# Altium schematic sheet Power_Regulators_RF_4.SchDoc
size A4; DocumentNumber: 38; SheetNumber: 38; SheetTotal: 47
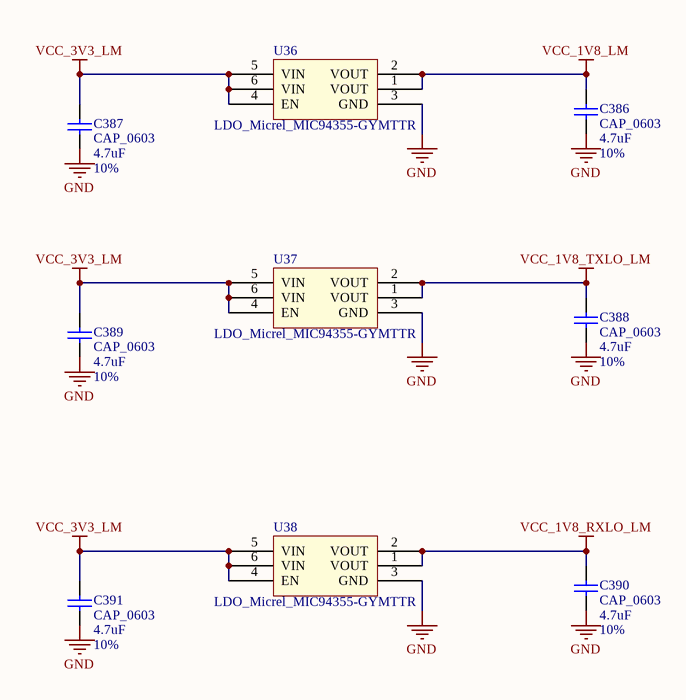
[diagram p0: Power_Regulators_RF_4.SchDoc]

## Parts
C386  CAP_0603  value 4.7uF  Tolerance: 10%  [CAPC0603(1608)100_N]
C387  CAP_0603  value 4.7uF  Tolerance: 10%  [CAPC0603(1608)100_N]
C388  CAP_0603  value 4.7uF  Tolerance: 10%  [CAPC0603(1608)100_N]
C389  CAP_0603  value 4.7uF  Tolerance: 10%  [CAPC0603(1608)100_N]
C390  CAP_0603  value 4.7uF  Tolerance: 10%  [CAPC0603(1608)100_N]
C391  CAP_0603  value 4.7uF  Tolerance: 10%  [CAPC0603(1608)100_N]
U36  LDO_Micrel_MIC94355-GYMTTR  [LDO_Micrel_MIC94325YMTTR_TDFN-6]
U37  LDO_Micrel_MIC94355-GYMTTR  [LDO_Micrel_MIC94325YMTTR_TDFN-6]
U38  LDO_Micrel_MIC94355-GYMTTR  [LDO_Micrel_MIC94325YMTTR_TDFN-6]

## Nets
GND: C386.1 C387.1 C388.1 C389.1 C390.1 C391.1 U36.3(GND) U37.3(GND) U38.3(GND)
VCC_1V8_LM: C386.2 U36.1(VOUT) U36.2(VOUT)
VCC_1V8_RXLO_LM: C390.2 U38.1(VOUT) U38.2(VOUT)
VCC_1V8_TXLO_LM: C388.2 U37.1(VOUT) U37.2(VOUT)
VCC_3V3_LM: C387.2 C389.2 C391.2 U36.4(EN) U36.5(VIN) U36.6(VIN) U37.4(EN) U37.5(VIN) U37.6(VIN) U38.4(EN) U38.5(VIN) U38.6(VIN)

## Library data of the parts
C386-C391 = LMK107BJ475KA-T: 4.7uF, ceramic, 10%, 10V X5R, 0603; Manufacturer: Taiyo Yuden; Part Number: LMK107BJ475KA-T; Footprint Ref: CAPC0603(1608)100_N; Library Ref: CAP_0603
U36-U38 = LDO_Micrel_MIC94355-GYMTTR: IC REG LDO 1.8V .5A 6TDFN; Manufacturer: Micrel Inc; Footprint Ref: LDO_Micrel_MIC94325YMTTR_TDFN-6; Library Ref: LDO_Micrel_MIC94355-GYMTTR; Part Number: MIC94355-GYMT TR